# Altium project ATACS.PrjPcb
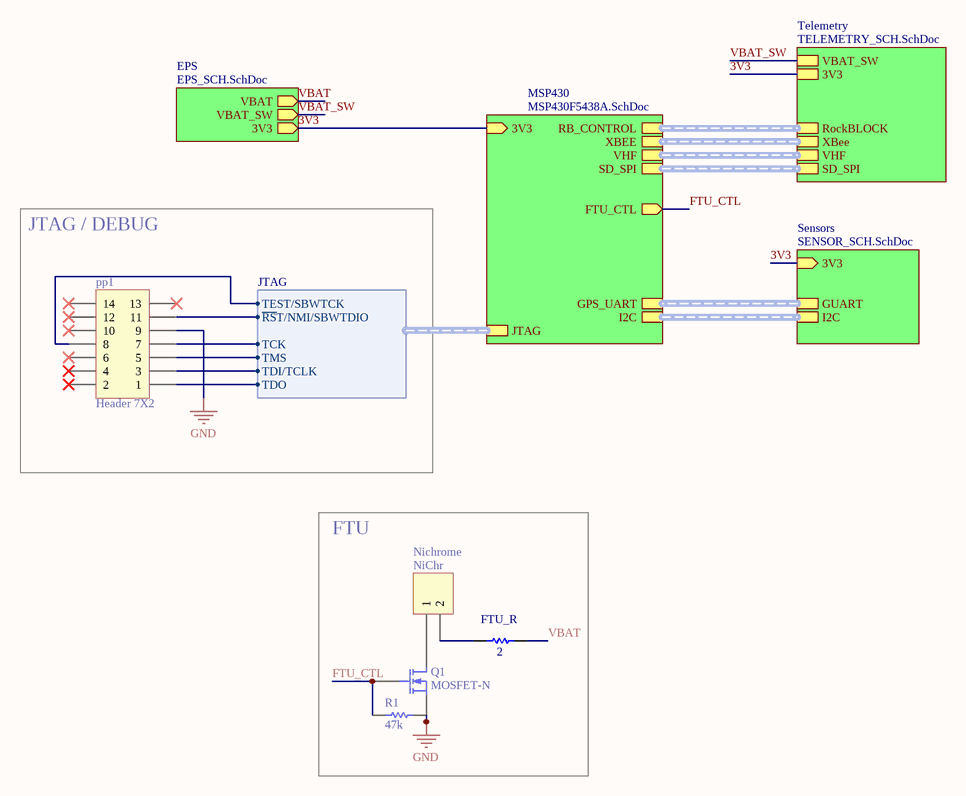
[diagram p0: ATACS_SCH.SchDoc]
5 sheets, 103 parts. Net scope: hierarchical (ports join the sheet entries above them; power ports are global).
Board file: ATACS_PCB.PcbDoc
Sheets:
  ATACS_SCH.SchDoc
    MSP430 = MSP430F5438A.SchDoc
    EPS = EPS_SCH.SchDoc
    Sensors = SENSOR_SCH.SchDoc
    Telemetry = TELEMETRY_SCH.SchDoc

## Sheet ATACS_SCH.SchDoc
size A

### Parts
FTU_R  value 2  [*RES_SMW52R0JT]  (hidden comment: Resistor)
NiChr  Nichrome  [Nichrome]
pp1  Header 7X2  [HDR2X7]
Q1  MOSFET-N  [MOSFET]
R1  value 47k  [J1-0603]  (hidden comment: Resistor)

### Blocks framed on the sheet
JTAG / DEBUG: pp1
FTU: FTU_R NiChr Q1 R1

### Sub-sheets
EPS = EPS_SCH.SchDoc: 3V3 (out), VBAT (out), VBAT_SW (out)
MSP430 = MSP430F5438A.SchDoc: RB_CONTROL (harness RockBLOCK), GPS_UART (harness UART), JTAG (harness JTAG), VHF (harness APRS Transmitter), I2C (harness I2C), XBEE (harness Short-Range XBee), 3V3 (in), FTU_CTL (out), SD_SPI (harness SD)
Sensors = SENSOR_SCH.SchDoc: 3V3 (in), GUART (harness Harness), I2C (harness I2C)
Telemetry = TELEMETRY_SCH.SchDoc: VBAT_SW, 3V3, XBee (harness XBee), VHF (harness VHF), RockBLOCK (harness RockBLOCK), SD_SPI (harness SPI)

### Harnesses
JTAG: ~{RS}T/NMI/SBWTDIO, TCK, TDI/TCLK, TDO, TEST/SBWTCK, TMS

### Nets
GND: pp1.9 Q1.3(S) R1.2
3V3: sheet MSP430/3V3, sheet EPS/3V3, sheet Sensors/3V3, sheet Telemetry/3V3
FTU_CTL: Q1.2(G) R1.1 ; sheet MSP430/FTU_CTL
RESET: pp1.11 ; sheet MSP430/JTAG.~{RS}T/NMI/SBWTDIO
TCK: pp1.7 ; sheet MSP430/JTAG.TCK
TDI: pp1.3 ; sheet MSP430/JTAG.TDI/TCLK
TDO: pp1.1 ; sheet MSP430/JTAG.TDO
TMS: pp1.5 ; sheet MSP430/JTAG.TMS
TST: pp1.8 ; sheet MSP430/JTAG.TEST/SBWTCK
VBAT: FTU_R.2 ; sheet EPS/VBAT
VBAT_SW: sheet EPS/VBAT_SW, sheet Telemetry/VBAT_SW
NetFTU_R_1: FTU_R.1 NiChr.2
NetNiChr_1: NiChr.1 Q1.1(D)

Not connected (* = marked no-connect by the designer): pp1 2* 4* 6* 10* 12* 13* 14*

### Buses and harness runs
harness sheet MSP430/GPS_UART = sheet Sensors/GUART
harness sheet MSP430/I2C = sheet Sensors/I2C
harness sheet MSP430/RB_CONTROL = sheet Telemetry/RockBLOCK
harness sheet MSP430/SD_SPI = sheet Telemetry/SD_SPI
harness sheet MSP430/VHF = sheet Telemetry/VHF
harness sheet MSP430/XBEE = sheet Telemetry/XBee

### Library data of the parts
FTU_R R1 = Resistor: Resistive element
NiChr = Header 2: Header, 2-Pin; LatestRevisionDate: 17-Jul-2002; LatestRevisionNote: Re-released for DXP Platform.; Publisher: Altium Limited
pp1 = Header 7X2: Header, 7-Pin, Dual row; LatestRevisionDate: 17-Jul-2002; LatestRevisionNote: Re-released for DXP Platform.; Publisher: Altium Limited
Q1 = MOSFET-N: N-Channel MOSFET; pin to pad: 1>2 2>1; Published: 8-Jun-2000; LatestRevisionDate: 17-Jul-2002; LatestRevisionNote: Re-released for DXP Platform.; PackageVersion: 1995/1996; PackageReference: E3; Publisher: Altium Limited; PackageDescription: TO, Flat Index; 3 In-Line, Axial Leads; Body Dia. 4.6mm; Lead Dia. 0.5 mm (max)

## Sheet MSP430F5438A.SchDoc: MSP430F5438A
size B; Author: Justin Shetty; Organization: University of Michigan; Address1: 1320 Beal Avenue; Address2: Ann Arbor, MI 48109; DocumentNumber: 8; Revision: v1.0; SheetNumber: 8; SheetTotal: 19
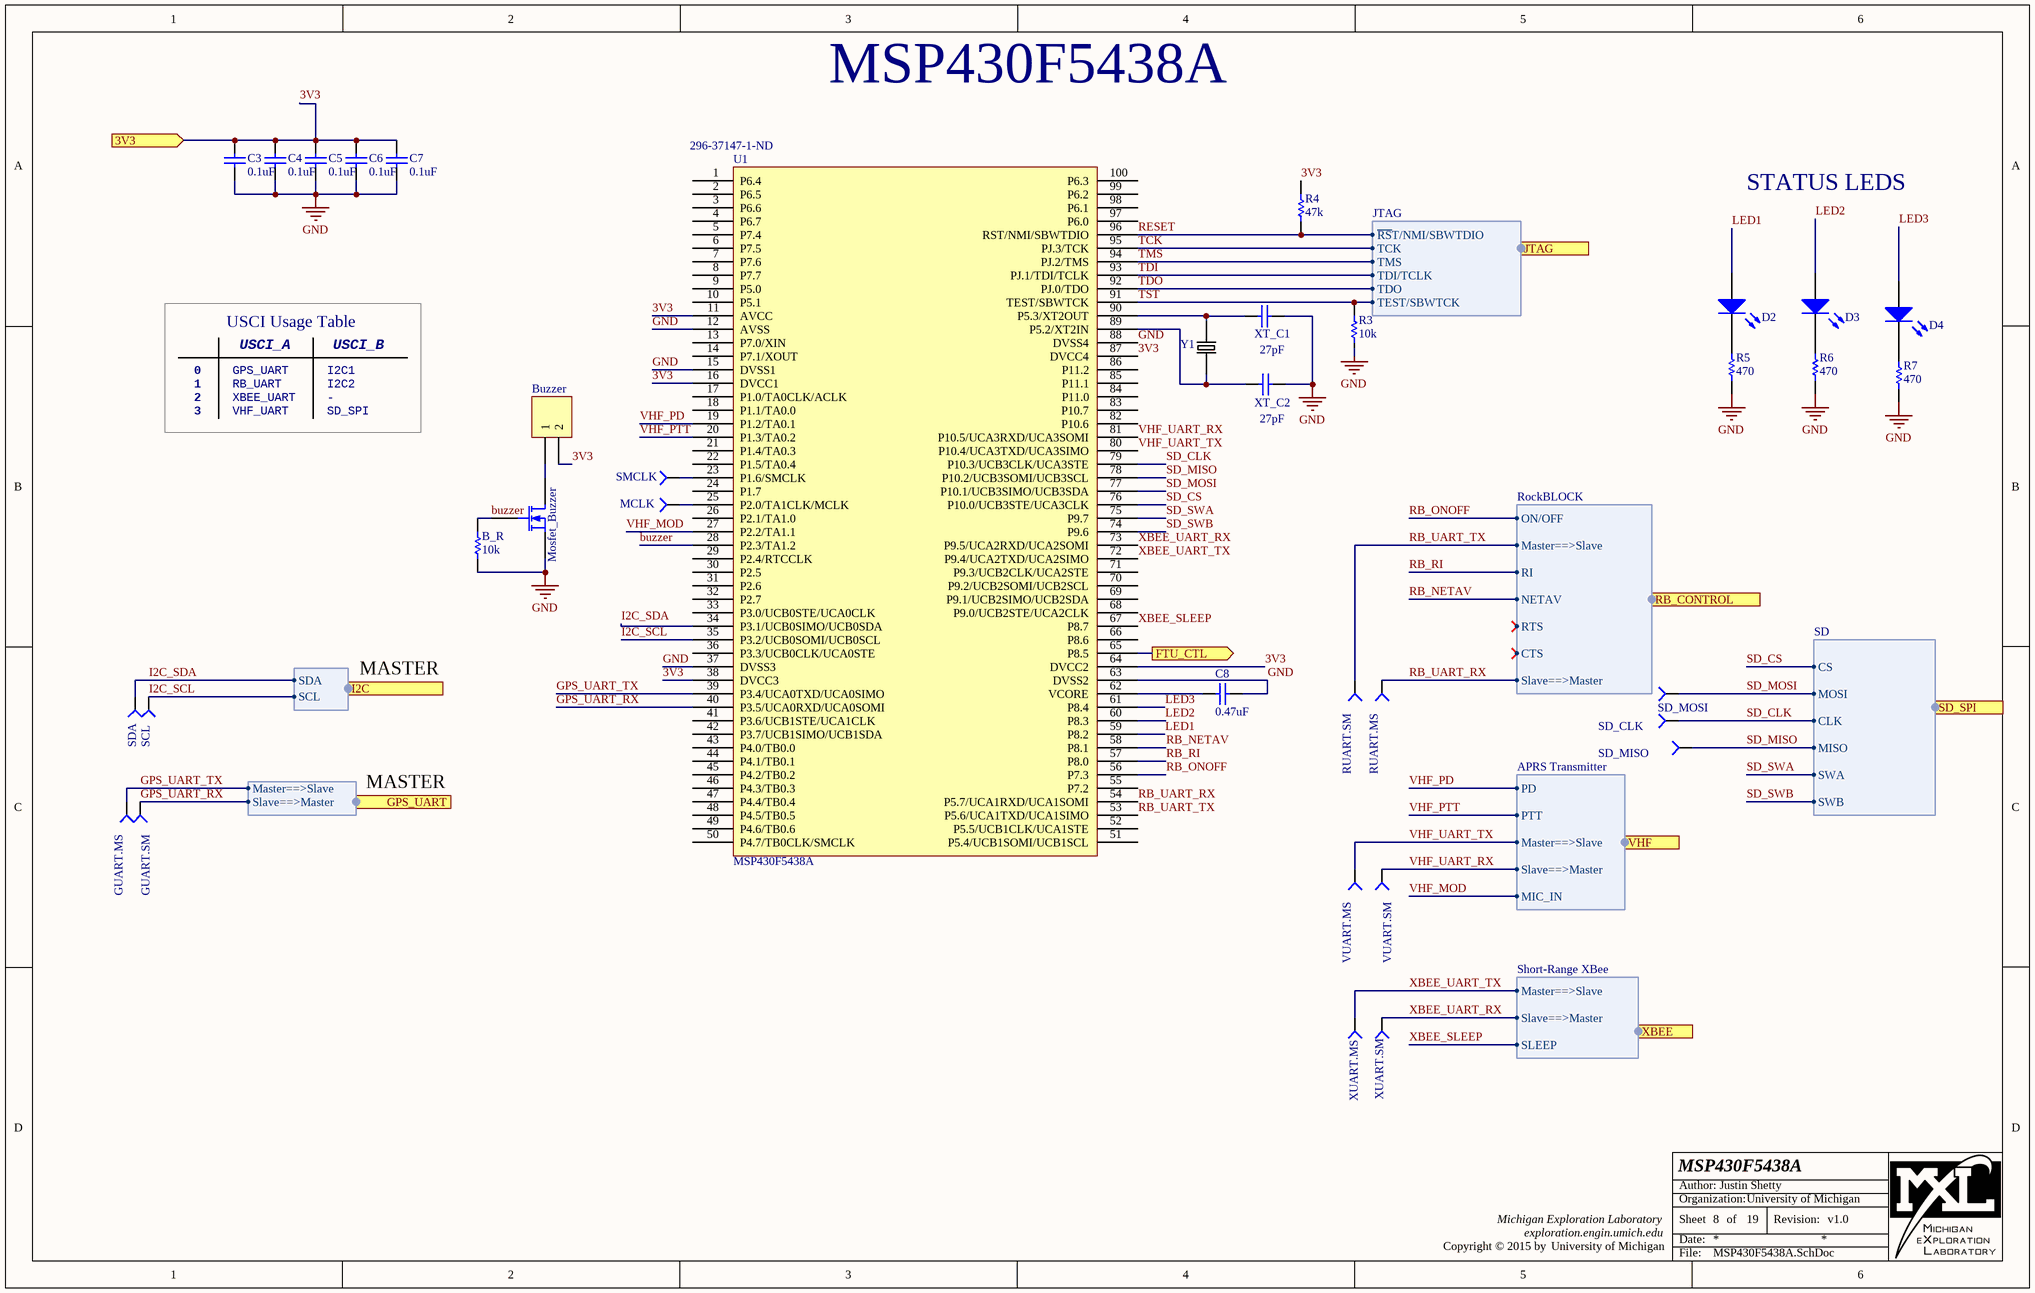
[diagram p1: MSP430F5438A.SchDoc]

### Parts
B_R  value 10k  [J1-0603]  (hidden comment: Resistor)
C3  value 0.1uF  [1608[0603]]  (hidden comment: Capacitor Ceramic)
C4  value 0.1uF  [1608[0603]]  (hidden comment: Capacitor Ceramic)
C5  value 0.1uF  [1608[0603]]  (hidden comment: Capacitor Ceramic)
C6  value 0.1uF  [1608[0603]]  (hidden comment: Capacitor Ceramic)
C7  value 0.1uF  [1608[0603]]  (hidden comment: Capacitor Ceramic)
C8  value 0.47uF  [1608[0603]]  (hidden comment: Capacitor Ceramic)
D2  LED  [J1-0603]  (value not drawn)
D3  LED  [J1-0603]  (value not drawn)
D4  LED  [J1-0603]  (value not drawn)
GUART.MS  Testpoint  [TESTPOINT]  (value not drawn)  (no BOM)
GUART.SM  Testpoint  [TESTPOINT]  (value not drawn)  (no BOM)
MCLK  Testpoint  [TESTPOINT]  (value not drawn)  (no BOM)
Mosfet_Buzzer  MOSFET-N  [SOT-23_M]  (value not drawn)
P4  Buzzer  [Buzzer]
R3  value 10k  [J1-0603]  (hidden comment: Resistor)
R4  value 47k  [J1-0603]  (hidden comment: Resistor)
R5  value 470  [J1-0603]  (hidden comment: Resistor)
R6  value 470  [J1-0603]  (hidden comment: Resistor)
R7  value 470  [J1-0603]  (hidden comment: Resistor)
RUART.MS  Testpoint  [TESTPOINT]  (value not drawn)  (no BOM)
RUART.SM  Testpoint  [TESTPOINT]  (value not drawn)  (no BOM)
SCL  Testpoint  [TESTPOINT]  (value not drawn)  (no BOM)
SD_CLK  Testpoint  [TESTPOINT]  (value not drawn)  (no BOM)
SD_MISO  Testpoint  [TESTPOINT]  (value not drawn)  (no BOM)
SD_MOSI  Testpoint  [TESTPOINT]  (value not drawn)  (no BOM)
SDA  Testpoint  [TESTPOINT]  (value not drawn)  (no BOM)
SMCLK  Testpoint  [TESTPOINT]  (value not drawn)  (no BOM)
U1  MSP430F5438A  Supplier Part Number 1: 296-37147-1-ND  [TSQFP50P1600X1600X160-100L]
VUART.MS  Testpoint  [TESTPOINT]  (value not drawn)  (no BOM)
VUART.SM  Testpoint  [TESTPOINT]  (value not drawn)  (no BOM)
XT_C1  value 27pF  [1608[0603]]  (hidden comment: Capacitor Ceramic)
XT_C2  value 27pF  [1608[0603]]  (hidden comment: Capacitor Ceramic)
XUART.MS  Testpoint  [TESTPOINT]  (value not drawn)  (no BOM)
XUART.SM  Testpoint  [TESTPOINT]  (value not drawn)  (no BOM)
Y1  ECS-160-18-5PXEN-TR  [*XTAL_ECS-160-18-5PXEN-TR]  (value not drawn)

### Ports
3V3 (in), FTU_CTL (out), GPS_UART (harness UART), I2C (harness I2C), JTAG (harness JTAG), RB_CONTROL (harness RockBLOCK), SD_SPI (harness SD), VHF (harness APRS Transmitter), XBEE (harness Short-Range XBee)

### Harnesses
JTAG: ~{RS}T/NMI/SBWTDIO, TCK, TDI/TCLK, TDO, TEST/SBWTCK, TMS
UART: Master==>Slave, Slave==>Master
I2C: SDA, SCL
RockBLOCK: ON/OFF, Master==>Slave, RI, NETAV, RTS, CTS, Slave==>Master
APRS Transmitter: PD, PTT, Master==>Slave, Slave==>Master, MIC_IN
Short-Range XBee: Master==>Slave, Slave==>Master, SLEEP
SD: CS, MOSI, CLK, MISO, SWA, SWB

### Nets
GND: B_R.1 C3.1 C4.1 C5.1 C6.1 C7.1 C8.2 Mosfet_Buzzer.3(S) R3.1 R5.1 R6.1 R7.1 U1.12(AVSS) U1.15(DVSS1) U1.37(DVSS3) U1.63(DVSS2) U1.88(DVSS4) XT_C1.1 XT_C2.1
3V3: C3.2 C4.2 C5.2 C6.2 C7.2 P4.2 R4.1 U1.11(AVCC) U1.16(DVCC1) U1.38(DVCC3) U1.64(DVCC2) U1.87(DVCC4) ; port 3V3
buzzer: B_R.2 Mosfet_Buzzer.2(G) U1.28(P2.3/TA1.2)
FTU_CTL: U1.65(P8.5) ; port FTU_CTL
GPS_UART_RX: GUART.SM.1 U1.40(P3.5/UCA0RXD/UCA0SOMI) ; port GPS_UART.Slave==>Master
GPS_UART_TX: GUART.MS.1 U1.39(P3.4/UCA0TXD/UCA0SIMO) ; port GPS_UART.Master==>Slave
I2C_SCL: SCL.1 U1.35(P3.2/UCB0SOMI/UCB0SCL) ; port I2C.SCL  [project net I2C SCL]
I2C_SDA: SDA.1 U1.34(P3.1/UCB0SIMO/UCB0SDA) ; port I2C.SDA  [project net I2C SDA]
LED1: D2.2(K) U1.59(P8.2)
LED2: D3.2(K) U1.60(P8.3)
LED3: D4.2(K) U1.61(P8.4)
RB_NETAV: U1.58(P8.1) ; port RB_CONTROL.NETAV
RB_ONOFF: U1.56(P7.3) ; port RB_CONTROL.ON/OFF
RB_RI: U1.57(P8.0) ; port RB_CONTROL.RI
RB_UART_RX: RUART.MS.1 U1.54(P5.7/UCA1RXD/UCA1SOMI) ; port RB_CONTROL.Slave==>Master
RB_UART_TX: RUART.SM.1 U1.53(P5.6/UCA1TXD/UCA1SIMO) ; port RB_CONTROL.Master==>Slave
RESET: R4.2 U1.96(RST/NMI/SBWTDIO) ; port JTAG.~{RS}T/NMI/SBWTDIO
SD_CLK: SD_CLK.1 U1.79(P10.3/UCB3CLK/UCA3STE) ; port SD_SPI.CLK
SD_CS: U1.76(P10.0/UCB3STE/UCA3CLK) ; port SD_SPI.CS
SD_MISO: SD_MISO.1 U1.78(P10.2/UCB3SOMI/UCB3SCL) ; port SD_SPI.MISO
SD_MOSI: SD_MOSI.1 U1.77(P10.1/UCB3SIMO/UCB3SDA) ; port SD_SPI.MOSI
SD_SWA: U1.75(P9.7) ; port SD_SPI.SWA
SD_SWB: U1.74(P9.6) ; port SD_SPI.SWB
TCK: U1.95(PJ.3/TCK) ; port JTAG.TCK
TDI: U1.93(PJ.1/TDI/TCLK) ; port JTAG.TDI/TCLK
TDO: U1.92(PJ.0/TDO) ; port JTAG.TDO
TMS: U1.94(PJ.2/TMS) ; port JTAG.TMS
TST: R3.2 U1.91(TEST/SBWTCK) ; port JTAG.TEST/SBWTCK
VHF_MOD: U1.27(P2.2/TA1.1) ; port VHF.MIC_IN  [project net RF_MIC_IN]
VHF_PD: U1.19(P1.2/TA0.1) ; port VHF.PD  [project net RF_PD]
VHF_PTT: U1.20(P1.3/TA0.2) ; port VHF.PTT  [project net RF_PTT]
VHF_UART_RX: U1.81(P10.5/UCA3RXD/UCA3SOMI) VUART.SM.1 ; port VHF.Slave==>Master  [project net RF_TXD]
VHF_UART_TX: U1.80(P10.4/UCA3TXD/UCA3SIMO) VUART.MS.1 ; port VHF.Master==>Slave  [project net RF_RXD]
XBEE_SLEEP: U1.67(P8.7) ; port XBEE.SLEEP  [project net XB_SLEEP]
XBEE_UART_RX: U1.73(P9.5/UCA2RXD/UCA2SOMI) XUART.SM.1 ; port XBEE.Slave==>Master  [project net XB_TX]
XBEE_UART_TX: U1.72(P9.4/UCA2TXD/UCA2SIMO) XUART.MS.1 ; port XBEE.Master==>Slave  [project net XB_RX]
NetC8_1: C8.1 U1.62(VCORE)
NetD2_1: D2.1(A) R5.2
NetD3_1: D3.1(A) R6.2
NetD4_1: D4.1(A) R7.2
NetMCLK_1: MCLK.1 U1.25(P2.0/TA1CLK/MCLK)
NetMosfet_Buzzer_1: Mosfet_Buzzer.1(D) P4.1
NetSMCLK_1: SMCLK.1 U1.23(P1.6/SMCLK)
NetU1_89: U1.89(P5.2/XT2IN) XT_C2.2 Y1.1
NetU1_90: U1.90(P5.3/XT2OUT) XT_C1.2 Y1.2

Not connected (* = marked no-connect by the designer): U1 1(P6.4) 2(P6.5) 3(P6.6) 4(P6.7) 5(P7.4) 6(P7.5) 7(P7.6) 8(P7.7) 9(P5.0) 10(P5.1) 13(P7.0/XIN) 14(P7.1/XOUT) 17(P1.0/TA0CLK/ACLK) 18(P1.1/TA0.0) 21(P1.4/TA0.3) 22(P1.5/TA0.4) 24(P1.7) 26(P2.1/TA1.0) 29(P2.4/RTCCLK) 30(P2.5) 31(P2.6) 32(P2.7) 33(P3.0/UCB0STE/UCA0CLK) 36(P3.3/UCB0CLK/UCA0STE) 41(P3.6/UCB1STE/UCA1CLK) 42(P3.7/UCB1SIMO/UCB1SDA) 43(P4.0/TB0.0) 44(P4.1/TB0.1) 45(P4.2/TB0.2) 46(P4.3/TB0.3) 47(P4.4/TB0.4) 48(P4.5/TB0.5) 49(P4.6/TB0.6) 50(P4.7/TB0CLK/SMCLK) 51(P5.4/UCB1SOMI/UCB1SCL) 52(P5.5/UCB1CLK/UCA1STE) 55(P7.2) 66(P8.6) 68(P9.0/UCB2STE/UCA2CLK) 69(P9.1/UCB2SIMO/UCB2SDA) 70(P9.2/UCB2SOMI/UCB2SCL) 71(P9.3/UCB2CLK/UCA2STE) 82(P10.6) 83(P10.7) 84(P11.0) 85(P11.1) 86(P11.2) 97(P6.0) 98(P6.1) 99(P6.2) 100(P6.3)

### Notes on the sheet
- MSP430F5438A
- STATUS LEDS
- USCI_A
- USCI Usage Table
- USCI_B
- 1
- 2
- 0
- 3
- GPS_UART
- XBEE_UART
- RB_UART
- VHF_UART
- I2C1
- -
- I2C2
- SD_SPI
- MASTER
- Michigan Exploration Laboratory
- exploration.engin.umich.edu
- Date:
- Sheet
- Author:
- Organization:
- of
- University of Michigan
- Revision:
- Copyright © 2015 by
- File:

### Library data of the parts
B_R R3-R7 = Resistor: Resistive element
GUART.MS GUART.SM MCLK RUART.MS RUART.SM SCL SD_CLK SD_MISO SD_MOSI SDA SMCLK VUART.MS VUART.SM XUART.MS XUART.SM = Testpoint: Probe point for testing
Mosfet_Buzzer = MOSFET-N: N-Channel MOSFET; pin to pad: 1>3 2>1 3>2; Published: 8-Jun-2000; LatestRevisionDate: 17-Jul-2002; LatestRevisionNote: Re-released for DXP Platform.; PackageVersion: 1995/1996; PackageReference: E3; Publisher: Altium Limited; PackageDescription: TO, Flat Index; 3 In-Line, Axial Leads; Body Dia. 4.6mm; Lead Dia. 0.5 mm (max)
P4 = Header 2: Header, 2-Pin; LatestRevisionDate: 17-Jul-2002; LatestRevisionNote: Re-released for DXP Platform.; Publisher: Altium Limited
U1 = MSP430F438IPZ: Manufacturer: Texas Instruments; Manufacturer Part Number: MSP430F5438AIPZR; Core Processor: MSP430; Core Size: 16-Bit; Speed: 25MHz; Connectivity: I²C, IrDA, LIN, SCI, SPI, UART/USART; Peripherals: Brown-out Detect/Reset, DMA, POR, PWM, WDT; Number of I/O: 87; Program Memory Size: 256KB (256K x 8); Program Memory Type: FLASH; RAM Size: 16K x 8; Voltage - Supply (Vcc/Vdd): 1.8 V ~ 3.6 V; Data Converters: A/D 16x12b; Oscillator Type: Internal; Digikey: 296-37147-1-ND; Supplier 1: Digi-Key; RoHS: RoHS Compliant; Category: Integrated Circuits (ICs); Stock 1: 6499; Pricing 1: 1=10.57, 10=9.5, 25=8.6404, 100=7.8215, 250=7.16624, 500=6.552, 750=6.01965, 1000=5.11875 (USD); Packaging: Cut Tape (CT); EEPROM Size: -; Operating Temperature: -40°C ~ 85°C; Package / Case: 100-LQFP; Supplier Device Package: 100-LQFP (14x14); ComponentLink1URL: http://www.ti.com/lit/ds/symlink/msp430f5418a.pdf; ComponentLink1Description: http://www.ti.com/lit/ds/symlink/msp430f5418a.pdf
Y1 = ECS-160-18-5PXEN-TR: Crystal 16MHz 18pF 2-Pin SMD T/R; MF: ECS Inc.; Digi-Key_Part_Number: XC1695CT-ND; Package: HC49/US ECS International; Digi-Key_Purchase_URL: https://www.digikey.com/product-detail/en/ecs-inc/ECS-160-18-5PXEN-TR/XC1695CT-ND/2213847?utm_source=snapeda&utm_medium=aggregator&utm_campaign=symbol; SnapEDA_Link: https://www.snapeda.com/parts/ECS-160-18-5PXEN-TR/ECS%20Inc./view-part/?ref=snap; MP: ECS-160-18-5PXEN-TR; Value: *

## Sheet EPS_SCH.SchDoc
size A
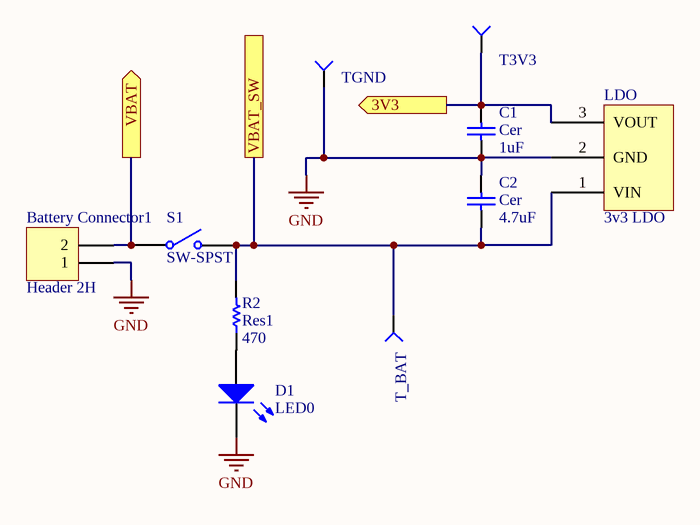
[diagram p2: EPS_SCH.SchDoc]

### Parts
Battery_Connector1  Header 2H  [BAT]
C1  Cer  value 1uF  [1608[0603]]
C2  Cer  value 4.7uF  [1608[0603]]
D1  LED0  [J1-0603]
LDO  3v3 LDO  [3V3LDO]
R2  Res1  value 470  [J1-0603]
S1  SW-SPST  [Switch]
T3V3  Testpoint  [TESTPOINT]  (value not drawn)  (no BOM)
T_BAT  Testpoint  [TESTPOINT]  (value not drawn)  (no BOM)
TGND  Testpoint  [TESTPOINT]  (value not drawn)  (no BOM)

### Ports
3V3 (out), VBAT (out), VBAT_SW

### Nets
GND: Battery_Connector1.1 C1.1 C2.2 D1.2(K) LDO.2(GND) TGND.1
3V3: C1.2 LDO.3(VOUT) T3V3.1 ; port 3V3
VBAT: Battery_Connector1.2 S1.1(COMMON) ; port VBAT
VBAT_SW: C2.1 LDO.1(VIN) R2.2 S1.2(NO) T_BAT.1 ; port VBAT_SW
NetD1_1: D1.1(A) R2.1

### Library data of the parts
Battery_Connector1 = Header 2H: Header, 2-Pin, Right Angle; LatestRevisionDate: 17-Jul-2002; LatestRevisionNote: Re-released for DXP Platform.; Publisher: Altium Limited
C1 C2 = Cap: Capacitor; Published: 8-Jun-2000; LatestRevisionDate: 17-Jul-2002; LatestRevisionNote: Re-released for DXP Platform.; PackageReference: RAD-0.3; Publisher: Altium Limited; PackageDescription: Radial Cap, Thru-Hole; 2 Leads; 0.3 in Pin Spacing
D1 = LED0: Typical INFRARED GaAs LED; Published: 8-Jun-2000; LatestRevisionDate: 08-Jul-2005; LatestRevisionNote: Mech Layer 1 removed.; PackageReference: LED-0; Publisher: Altium Limited; PackageDescription: LED; 2 Leads
LDO = 3v3 LDO: MCP1826S-3302E/AB
R2 = Res1: Resistor; Published: 8-Jun-2000; LatestRevisionDate: 17-Jul-2002; LatestRevisionNote: Re-released for DXP Platform.; PackageReference: AXIAL-0.3; Publisher: Altium Limited; PackageDescription: Axial Device, Thru-Hole; 2 Leads; 0.3 in Pin Spacing
S1 = SW-SPST: Single-Pole, Single-Throw Switch; Published: 24-Mar-1999; LatestRevisionDate: 17-Jul-2002; LatestRevisionNote: Re-released for DXP Platform.; PackageReference: SPST-2; Publisher: Altium Limited; PackageDescription: Switch; 2 Leads
T3V3 T_BAT TGND = Testpoint: Probe point for testing

## Sheet SENSOR_SCH.SchDoc
size A
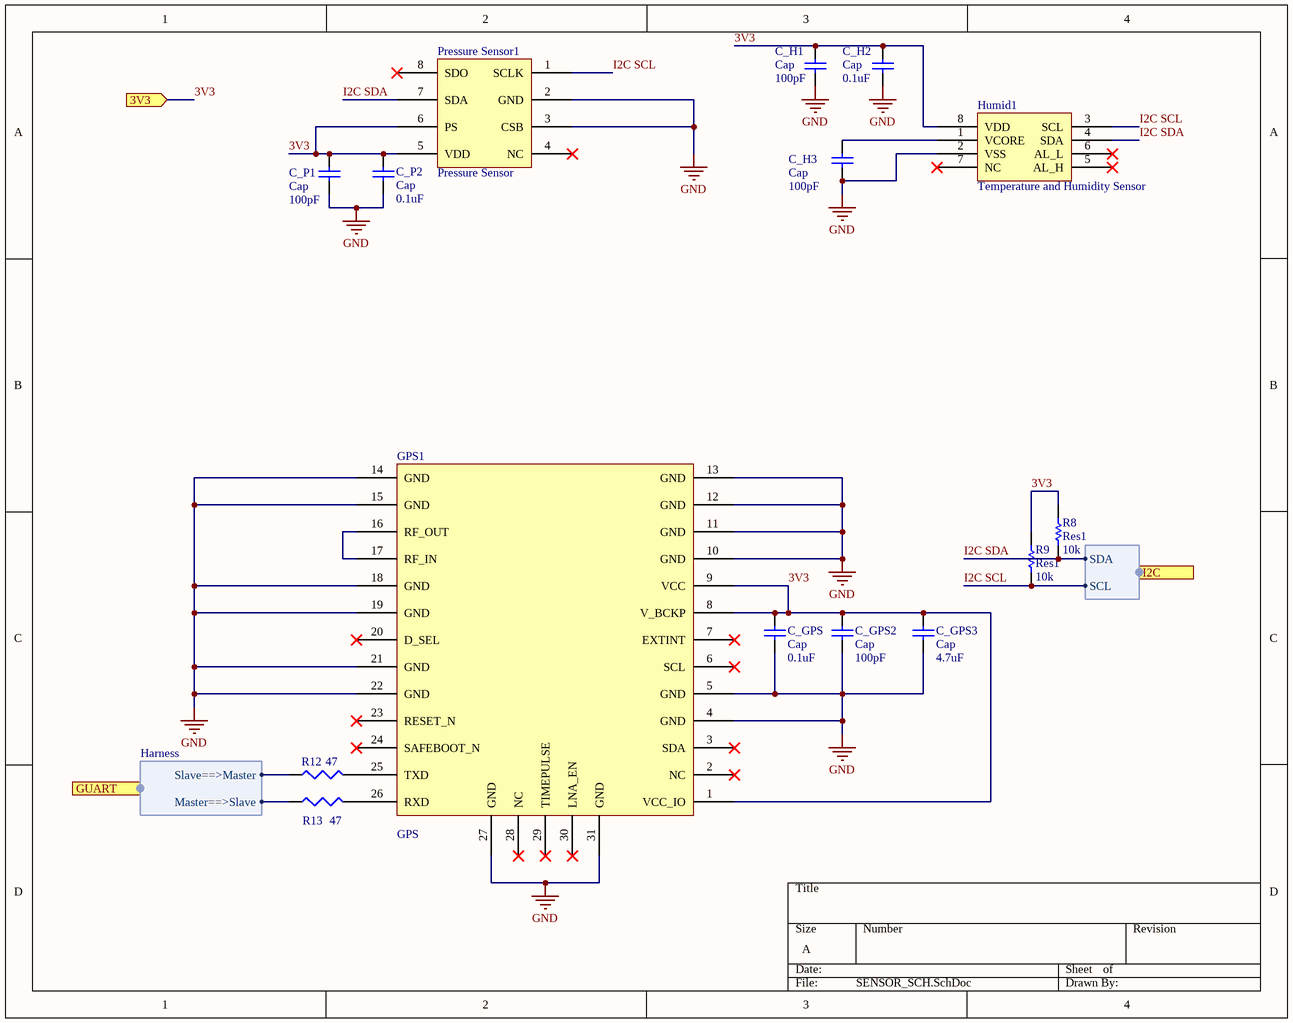
[diagram p3: SENSOR_SCH.SchDoc]

### Parts
C_GPS  Cap  value 0.1uF  [1608[0603]]
C_GPS2  Cap  value 100pF  [1608[0603]]
C_GPS3  Cap  value 4.7uF  [1608[0603]]
C_H1  Cap  value 100pF  [1608[0603]]
C_H2  Cap  value 0.1uF  [1608[0603]]
C_H3  Cap  value 100pF  [1608[0603]]
C_P1  Cap  value 100pF  [1608[0603]]
C_P2  Cap  value 0.1uF  [1608[0603]]
GPS1  GPS  [CAM M8C GPS]
Humid1  Temperature and Humidity Sensor  [Humidity Sensor]
Pressure_Sensor1  Pressure Sensor  [Pressure Sensor]
R8  Res1  value 10k  [J1-0603]
R9  Res1  value 10k  [J1-0603]
R12  value 47  [J1-0603]  (hidden comment: Res3)
R13  value 47  [J1-0603]  (hidden comment: Res3)

### Ports
3V3 (in), GUART (harness Harness), I2C (harness I2C)

### Harnesses
Harness: Slave==>Master, Master==>Slave
I2C: SDA, SCL

### Nets
GND: C_GPS.1 C_GPS2.1 C_GPS3.1 C_H1.1 C_H2.1 C_H3.1 C_P1.1 C_P2.1 GPS1.4(GND) GPS1.5(GND) GPS1.10(GND) GPS1.11(GND) GPS1.12(GND) GPS1.13(GND) GPS1.14(GND) GPS1.15(GND) GPS1.18(GND) GPS1.19(GND) GPS1.21(GND) GPS1.22(GND) GPS1.27(GND) GPS1.31(GND) Humid1.2(VSS) Pressure_Sensor1.2(GND) Pressure_Sensor1.3(CSB)
3V3: C_GPS.2 C_GPS2.2 C_GPS3.2 C_H1.2 C_H2.2 C_P1.2 C_P2.2 GPS1.1(VCC_IO) GPS1.8(V_BCKP) GPS1.9(VCC) Humid1.8(VDD) Pressure_Sensor1.5(VDD) Pressure_Sensor1.6(PS) R8.2 R9.2 ; port 3V3
GPS_UART_RX: R12.1 ; port GUART.Slave==>Master
GPS_UART_TX: R13.1 ; port GUART.Master==>Slave
I2C SCL: Humid1.3(SCL) Pressure_Sensor1.1(SCLK) R9.1 ; port I2C.SCL
I2C SDA: Humid1.4(SDA) Pressure_Sensor1.7(SDA) R8.1 ; port I2C.SDA
NetC_H3_2: C_H3.2 Humid1.1(VCORE)
NetGPS1_16: GPS1.16(RF_OUT) GPS1.17(RF_IN)
NetGPS1_25: GPS1.25(TXD) R12.2
NetGPS1_26: GPS1.26(RXD) R13.2

Not connected (* = marked no-connect by the designer): GPS1 2(NC)* 3(SDA)* 6(SCL)* 7(EXTINT)* 20(D_SEL)* 23(RESET_N)* 24(SAFEBOOT_N)* 28(NC)* 29(TIMEPULSE)* 30(LNA_EN)*; Humid1 5(AL_H)* 6(AL_L)* 7(NC)*; Pressure_Sensor1 4(NC)* 8(SDO)*

### Library data of the parts
C_GPS C_GPS2 C_GPS3 C_H1-C_H3 C_P1 C_P2 = Cap: Capacitor; Published: 8-Jun-2000; LatestRevisionDate: 17-Jul-2002; LatestRevisionNote: Re-released for DXP Platform.; PackageReference: RAD-0.3; Publisher: Altium Limited; PackageDescription: Radial Cap, Thru-Hole; 2 Leads; 0.3 in Pin Spacing
GPS1 = GPS: CAM M8C
Humid1 = Temperature and Humidity Sensor: HIH6030-021-001
Pressure_Sensor1 = Pressure Sensor: MS580301BA01-00
R8 R9 = Res1: Resistor; Published: 8-Jun-2000; LatestRevisionDate: 17-Jul-2002; LatestRevisionNote: Re-released for DXP Platform.; PackageReference: AXIAL-0.3; Publisher: Altium Limited; PackageDescription: Axial Device, Thru-Hole; 2 Leads; 0.3 in Pin Spacing
R12 R13 = Res3: Resistor; Published: 8-Jun-2000; LatestRevisionDate: 29-May-2009; LatestRevisionNote: IPC-7351 Footprint Added.; PackageReference: J1-0603; Publisher: Altium Limited; PackageDescription: Chip Resistor

## Sheet TELEMETRY_SCH.SchDoc
size A
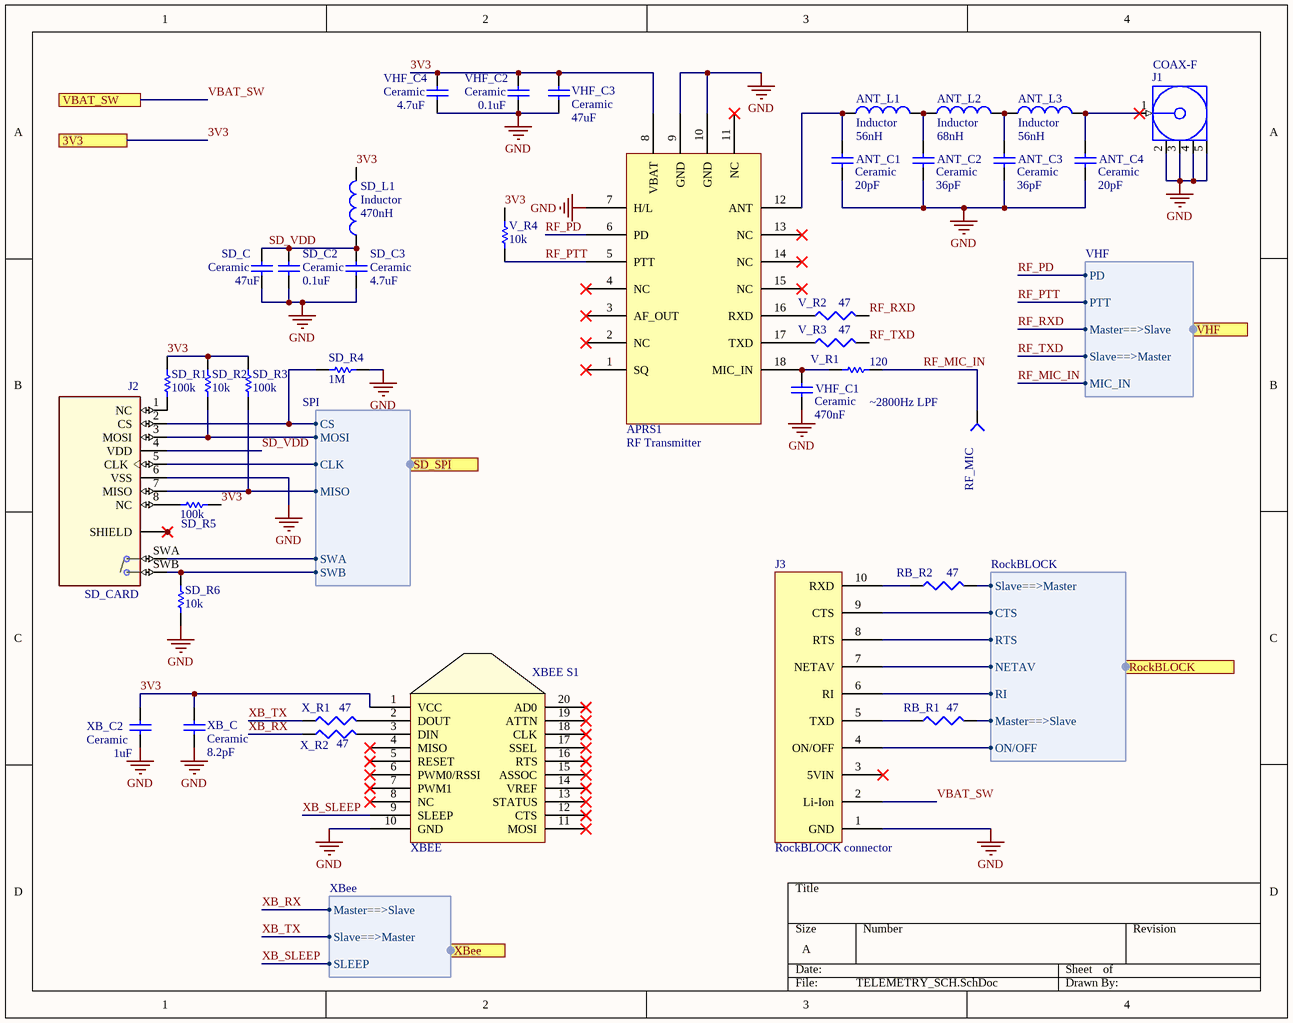
[diagram p4: TELEMETRY_SCH.SchDoc]

### Parts
ANT_C1  Ceramic  value 20pF  [1608[0603]]
ANT_C2  Ceramic  value 36pF  [1608[0603]]
ANT_C3  Ceramic  value 36pF  [1608[0603]]
ANT_C4  Ceramic  value 20pF  [1608[0603]]
ANT_L1  Inductor  value 56nH  [J1-0603]
ANT_L2  Inductor  value 68nH  [J1-0603]
ANT_L3  Inductor  value 56nH  [J1-0603]
APRS1  RF Transmitter  [APRS Transmitter]
J1  COAX-F  [MCX_RF_SMA_F]
J2  SD_CARD  [SD_CARD]
J3  RockBLOCK connector  [RockBLOCK Connector]
RB_R1  value 47  [J1-0603]  (hidden comment: Res3)
RB_R2  value 47  [J1-0603]  (hidden comment: Res3)
RF_MIC  Testpoint  [TESTPOINT]  (value not drawn)  (no BOM)
SD_C  Ceramic  value 47uF  [1608[0603]]
SD_C2  Ceramic  value 0.1uF  [1608[0603]]
SD_C3  Ceramic  value 4.7uF  [1608[0603]]
SD_L1  Inductor  value 470nH  [J1-0603]
SD_R1  value 100k  [J1-0603]  (hidden comment: Resistor)
SD_R2  value 10k  [J1-0603]  (hidden comment: Resistor)
SD_R3  value 100k  [J1-0603]  (hidden comment: Resistor)
SD_R4  value 1M  [J1-0603]  (hidden comment: Resistor)
SD_R5  value 100k  [J1-0603]  (hidden comment: Resistor)
SD_R6  value 10k  [J1-0603]  (hidden comment: Resistor)
V_R1  value 120  [J1-0603]  (hidden comment: Resistor)
V_R2  value 47  [J1-0603]  (hidden comment: Res3)
V_R3  value 47  [J1-0603]  (hidden comment: Res3)
V_R4  value 10k  [J1-0603]  (hidden comment: Resistor)
VHF_C1  Ceramic  value 470nF  [1608[0603]]
VHF_C2  Ceramic  value 0.1uF  [1608[0603]]
VHF_C3  Ceramic  value 47uF  [1608[0603]]
VHF_C4  Ceramic  value 4.7uF  [1608[0603]]
X_R1  value 47  [J1-0603]  (hidden comment: Res3)
X_R2  value 47  [J1-0603]  (hidden comment: Res3)
XB_C  Ceramic  value 8.2pF  [1608[0603]]
XB_C2  Ceramic  value 1uF  [1608[0603]]
XBEE_S1  XBEE  [XBEE]

### Ports
3V3, RockBLOCK (harness RockBLOCK), SD_SPI (harness SPI), VBAT_SW, VHF (harness VHF), XBee (harness XBee)

### Harnesses
RockBLOCK: ON/OFF, Master==>Slave, RI, NETAV, RTS, CTS, Slave==>Master
VHF: PD, PTT, Master==>Slave, Slave==>Master, MIC_IN
XBee: Master==>Slave, Slave==>Master, SLEEP
SPI: CS, MOSI, CLK, MISO, SWA, SWB

### Nets
GND: ANT_C1.1 ANT_C2.1 ANT_C3.1 ANT_C4.1 APRS1.7(H/L) APRS1.9(GND) APRS1.10(GND) J1.2(GND) J1.3(GND) J1.4(GND) J1.5(GND) J2.6(VSS) J3.1(GND) SD_C.1 SD_C2.1 SD_C3.1 SD_R4.1 SD_R6.1 VHF_C1.1 VHF_C2.1 VHF_C3.1 VHF_C4.1 XB_C.1 XB_C2.1 XBEE_S1.10(GND)
3V3: APRS1.8(VBAT) SD_L1.2 SD_R1.2 SD_R2.2 SD_R3.2 SD_R5.1 V_R4.2 VHF_C2.2 VHF_C3.2 VHF_C4.2 XB_C.2 XB_C2.2 XBEE_S1.1(VCC) ; port 3V3
RB_NETAV: J3.7(NETAV) ; port RockBLOCK.NETAV
RB_ONOFF: J3.4(ON/OFF) ; port RockBLOCK.ON/OFF
RB_RI: J3.6(RI) ; port RockBLOCK.RI
RB_UART_RX: RB_R2.2 ; port RockBLOCK.Slave==>Master
RB_UART_TX: RB_R1.2 ; port RockBLOCK.Master==>Slave
RF_MIC_IN: RF_MIC.1 V_R1.2 ; port VHF.MIC_IN
RF_PD: APRS1.6(PD) ; port VHF.PD
RF_PTT: APRS1.5(PTT) V_R4.1 ; port VHF.PTT
RF_RXD: V_R2.2 ; port VHF.Master==>Slave
RF_TXD: V_R3.2 ; port VHF.Slave==>Master
SD_CLK: J2.5(CLK) ; port SD_SPI.CLK
SD_CS: J2.2(CS) SD_R4.2 ; port SD_SPI.CS
SD_MISO: J2.7(MISO) SD_R3.1 ; port SD_SPI.MISO
SD_MOSI: J2.3(MOSI) SD_R2.1 ; port SD_SPI.MOSI
SD_SWA: J2.SWA(A) ; port SD_SPI.SWA
SD_SWB: J2.SWB(B) SD_R6.2 ; port SD_SPI.SWB
SD_VDD: J2.4(VDD) SD_C.2 SD_C2.2 SD_C3.2 SD_L1.1
VBAT_SW: J3.2(Li-Ion) ; port VBAT_SW
XB_RX: X_R2.1 ; port XBee.Master==>Slave
XB_SLEEP: XBEE_S1.9(SLEEP) ; port XBee.SLEEP
XB_TX: X_R1.1 ; port XBee.Slave==>Master
NetANT_C1_2: ANT_C1.2 ANT_L1.1 APRS1.12(ANT)
NetANT_C2_2: ANT_C2.2 ANT_L1.2 ANT_L2.1
NetANT_C3_2: ANT_C3.2 ANT_L2.2 ANT_L3.1
NetANT_C4_2: ANT_C4.2 ANT_L3.2 J1.1(Signal)
NetAPRS1_16: APRS1.16(RXD) V_R2.1
NetAPRS1_17: APRS1.17(TXD) V_R3.1
NetAPRS1_18: APRS1.18(MIC_IN) V_R1.1 VHF_C1.2
NetJ2_1: J2.1(NC) SD_R1.1
NetJ2_8: J2.8(NC) SD_R5.2
NetJ2_P1: J2.P1(SHIELD) J2.P2(SHIELD) J2.P3(SHIELD) J2.P4(SHIELD)
NetJ3_5: J3.5(TXD) RB_R1.1
NetJ3_8: J3.8(RTS) ; port RockBLOCK.RTS
NetJ3_9: J3.9(CTS) ; port RockBLOCK.CTS
NetJ3_10: J3.10(RXD) RB_R2.1
NetX_R1_2: X_R1.2 XBEE_S1.2(DOUT)
NetX_R2_2: X_R2.2 XBEE_S1.3(DIN)

Not connected (* = marked no-connect by the designer): APRS1 1(SQ)* 2(NC)* 3(AF_OUT)* 4(NC)* 11(NC)* 13(NC)* 14(NC)* 15(NC)*; J3 3(5VIN)*; XBEE_S1 4(MISO)* 5(RESET)* 6(PWM0/RSSI)* 7(PWM1)* 8(NC)* 11(MOSI)* 12(CTS)* 13(STATUS)* 14(VREF)* 15(ASSOC)* 16(RTS)* 17(SSEL)* 18(CLK)* 19(ATTN)* 20(AD0)*

### Notes on the sheet
- ~2800Hz LPF

### Library data of the parts
ANT_C1-ANT_C4 SD_C SD_C2 SD_C3 VHF_C1-VHF_C4 XB_C XB_C2 = Cap: Capacitor; Published: 8-Jun-2000; LatestRevisionDate: 17-Jul-2002; LatestRevisionNote: Re-released for DXP Platform.; PackageReference: RAD-0.3; Publisher: Altium Limited; PackageDescription: Radial Cap, Thru-Hole; 2 Leads; 0.3 in Pin Spacing
ANT_L1-ANT_L3 SD_L1 = Inductor: Code_IEC: 1005; Published: 8-Jun-2000; LatestRevisionDate: 29-May-2009; LatestRevisionNote: IPC-7351 Footprint Added.; PackageReference: 0402-A; Publisher: Altium Limited; PackageDescription: Chip Inductor; Code_JEITA: 0402
APRS1 = RF Transmitter: DRA818V
J1 = COAX-F: RF Coaxial PCB Connector, MCX; Thru-Hole, Right-Angle Mount Socket, Blunt Post Terminal, 50 Ohm Impedance; PCB_Layout: Complies with manufacturer's recommendation.; DrillSize: Corresponds to nominal value.; Published: 15-Jul-2004; LatestRevisionDate: 15-Jul-2004; LatestRevisionNote: Component Replaced.; DatasheetDocument: 30-May-2003; PackageDocument: 04-Jul-1999; PackageReference: 919-119J-51AX; Publisher: Altium Limited; ComponentLink1Description: Manufacturer Link; ComponentLink1URL: http://www.amphenolrf.com/
J2 = DM3AT-SF-PEJM5: DM3 RA SMT microSD memory card push/push; MF: Hirose; Digi-Key_Part_Number: HR1964CT-ND; Package: None; SnapEDA_Link: https://www.snapeda.com/parts/DM3AT-SF-PEJM5/Hirose%20Electric%20Co%20Ltd/view-part/?ref=snap; Digi-Key_Purchase_URL: https://www.digikey.com/product-detail/en/hirose-electric-co-ltd/DM3AT-SF-PEJM5/HR1964CT-ND/2533566?utm_source=snapeda&utm_medium=aggregator&utm_campaign=symbol; MP: DM3AT-SF-PEJM5; Value: *
RB_R1 RB_R2 V_R2 V_R3 X_R1 X_R2 = Res3: Resistor; Published: 8-Jun-2000; LatestRevisionDate: 29-May-2009; LatestRevisionNote: IPC-7351 Footprint Added.; PackageReference: J1-0603; Publisher: Altium Limited; PackageDescription: Chip Resistor
RF_MIC = Testpoint: Probe point for testing
SD_R1-SD_R6 V_R1 V_R4 = Resistor: Resistive element
XBEE_S1 = XBEE: XB24CZ7WIT-004

## Nets that join several sheets
GND: ATACS_SCH (pp1.9 Q1.3 R1.2), MSP430F5438A (19 pins), EPS_SCH (6 pins), SENSOR_SCH (25 pins), TELEMETRY_SCH (25 pins)
3V3: MSP430F5438A (12 pins), EPS_SCH (C1.2 LDO.3 T3V3.1), SENSOR_SCH (15 pins), TELEMETRY_SCH (13 pins)
FTU_CTL: ATACS_SCH (Q1.2 R1.1), MSP430F5438A (U1.65)
GPS_UART_RX: MSP430F5438A (GUART.SM.1 U1.40), SENSOR_SCH (R12.1)
GPS_UART_TX: MSP430F5438A (GUART.MS.1 U1.39), SENSOR_SCH (R13.1)
I2C SCL: MSP430F5438A (SCL.1 U1.35), SENSOR_SCH (Humid1.3 Pressure_Sensor1.1 R9.1)
I2C SDA: MSP430F5438A (SDA.1 U1.34), SENSOR_SCH (Humid1.4 Pressure_Sensor1.7 R8.1)
RB_NETAV: MSP430F5438A (U1.58), TELEMETRY_SCH (J3.7)
RB_ONOFF: MSP430F5438A (U1.56), TELEMETRY_SCH (J3.4)
RB_RI: MSP430F5438A (U1.57), TELEMETRY_SCH (J3.6)
RB_UART_RX: MSP430F5438A (RUART.MS.1 U1.54), TELEMETRY_SCH (RB_R2.2)
RB_UART_TX: MSP430F5438A (RUART.SM.1 U1.53), TELEMETRY_SCH (RB_R1.2)
RESET: ATACS_SCH (pp1.11), MSP430F5438A (R4.2 U1.96)
RF_MIC_IN: MSP430F5438A (U1.27), TELEMETRY_SCH (RF_MIC.1 V_R1.2)
RF_PD: MSP430F5438A (U1.19), TELEMETRY_SCH (APRS1.6)
RF_PTT: MSP430F5438A (U1.20), TELEMETRY_SCH (APRS1.5 V_R4.1)
RF_RXD: MSP430F5438A (U1.80 VUART.MS.1), TELEMETRY_SCH (V_R2.2)
RF_TXD: MSP430F5438A (U1.81 VUART.SM.1), TELEMETRY_SCH (V_R3.2)
SD_CLK: MSP430F5438A (SD_CLK.1 U1.79), TELEMETRY_SCH (J2.5)
SD_CS: MSP430F5438A (U1.76), TELEMETRY_SCH (J2.2 SD_R4.2)
SD_MISO: MSP430F5438A (SD_MISO.1 U1.78), TELEMETRY_SCH (J2.7 SD_R3.1)
SD_MOSI: MSP430F5438A (SD_MOSI.1 U1.77), TELEMETRY_SCH (J2.3 SD_R2.1)
SD_SWA: MSP430F5438A (U1.75), TELEMETRY_SCH (J2.SWA)
SD_SWB: MSP430F5438A (U1.74), TELEMETRY_SCH (J2.SWB SD_R6.2)
TCK: ATACS_SCH (pp1.7), MSP430F5438A (U1.95)
TDI: ATACS_SCH (pp1.3), MSP430F5438A (U1.93)
TDO: ATACS_SCH (pp1.1), MSP430F5438A (U1.92)
TMS: ATACS_SCH (pp1.5), MSP430F5438A (U1.94)
TST: ATACS_SCH (pp1.8), MSP430F5438A (R3.2 U1.91)
VBAT: ATACS_SCH (FTU_R.2), EPS_SCH (Battery_Connector1.2 S1.1)
VBAT_SW: EPS_SCH (5 pins), TELEMETRY_SCH (J3.2)
XB_RX: MSP430F5438A (U1.72 XUART.MS.1), TELEMETRY_SCH (X_R2.1)
XB_SLEEP: MSP430F5438A (U1.67), TELEMETRY_SCH (XBEE_S1.9)
XB_TX: MSP430F5438A (U1.73 XUART.SM.1), TELEMETRY_SCH (X_R1.1)